# Altium schematic sheet Sheet2.SchDoc
size A3; SheetNumber: 1; SheetTotal: 1
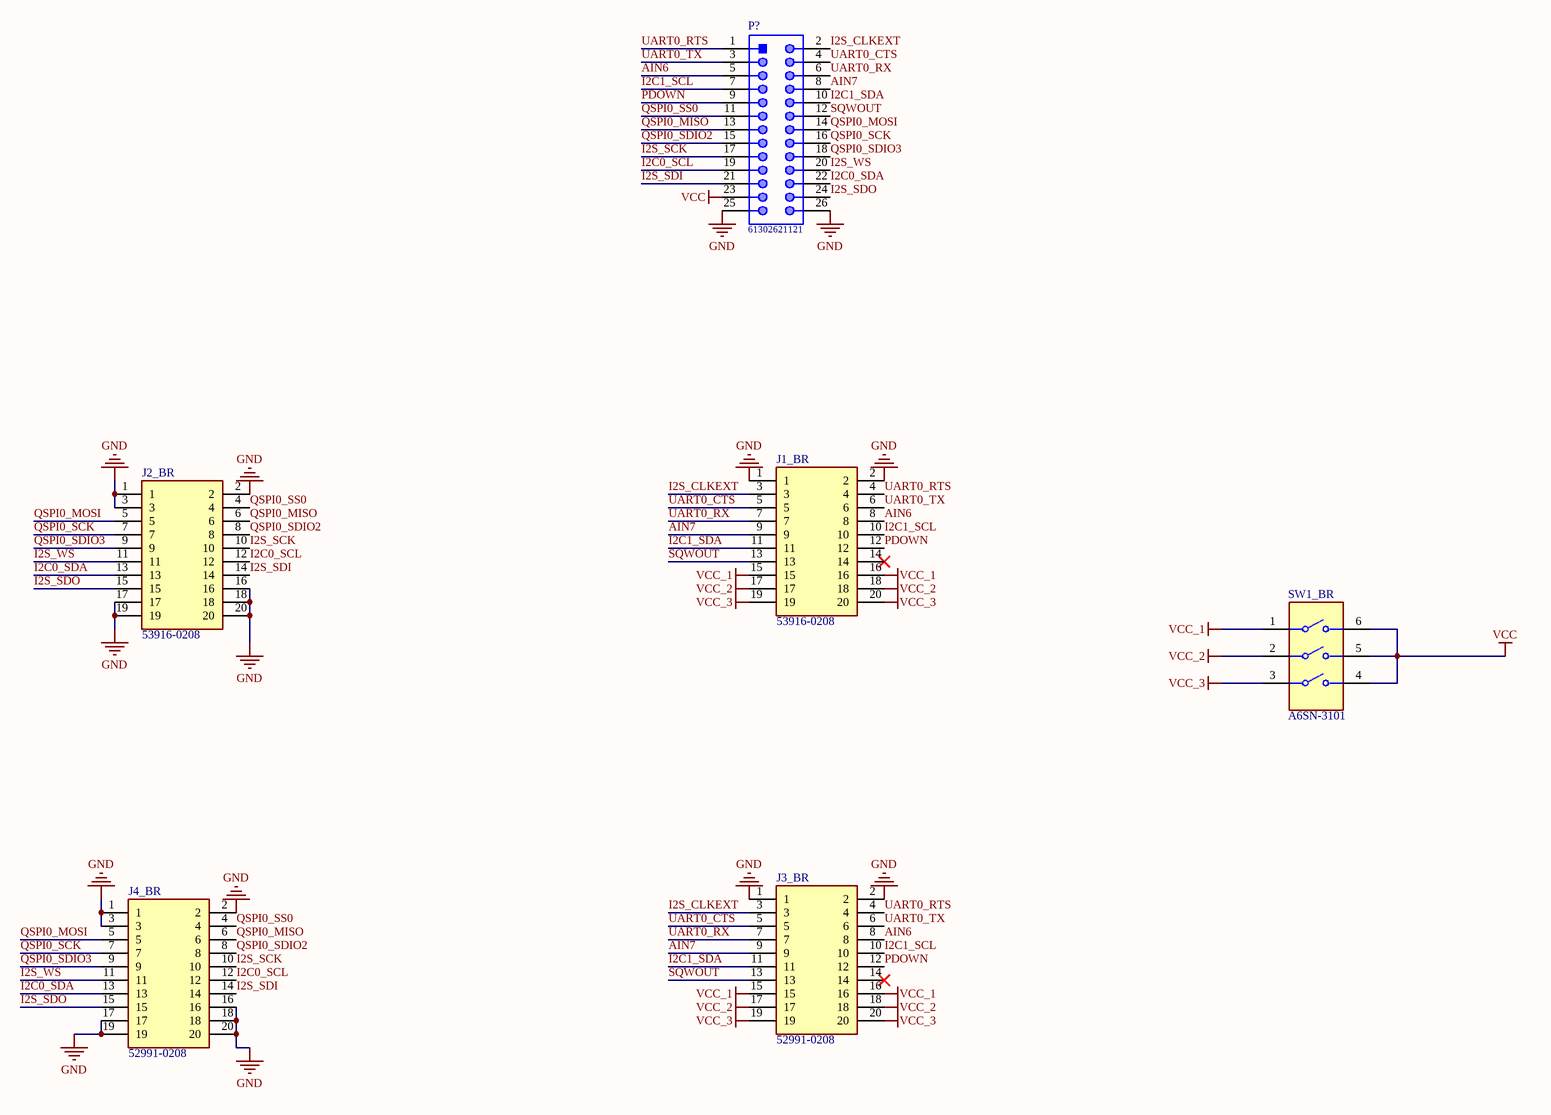
[diagram p0: Sheet2.SchDoc]

## Parts
J1_BR  53916-0208  [MOLEX-  539160208]
J2_BR  53916-0208  [MOLEX-  539160208]
J3_BR  52991-0208  [MOLEX_52991-0208]
J4_BR  52991-0208  [MOLEX_52991-0208]
P?  61302621121  [61302621121]
SW1_BR  A6SN-3101  [FP-A6SN-3101-MFG]

## Nets
GND: J1_BR.1 J1_BR.2 J2_BR.1 J2_BR.2 J2_BR.3 J2_BR.16 J2_BR.17 J2_BR.18 J2_BR.19 J2_BR.20 J3_BR.1 J3_BR.2 J4_BR.1 J4_BR.2 J4_BR.3 J4_BR.16 J4_BR.17 J4_BR.18 J4_BR.19 J4_BR.20 P?.25 P?.26
VCC: P?.23 SW1_BR.4 SW1_BR.5 SW1_BR.6
VCC_1: J1_BR.15 J1_BR.16 J3_BR.15 J3_BR.16 SW1_BR.1
VCC_2: J1_BR.17 J1_BR.18 J3_BR.17 J3_BR.18 SW1_BR.2
VCC_3: J1_BR.19 J1_BR.20 J3_BR.19 J3_BR.20 SW1_BR.3
AIN6: J1_BR.8 J3_BR.8 P?.5
AIN7: J1_BR.9 J3_BR.9 P?.8
I2C0_SCL: J2_BR.12 J4_BR.12 P?.19
I2C0_SDA: J2_BR.13 J4_BR.13 P?.22
I2C1_SCL: J1_BR.10 J3_BR.10 P?.7
I2C1_SDA: J1_BR.11 J3_BR.11 P?.10
I2S_CLKEXT: J1_BR.3 J3_BR.3 P?.2
I2S_SCK: J2_BR.10 J4_BR.10 P?.17
I2S_SDI: J2_BR.14 J4_BR.14 P?.21
I2S_SDO: J2_BR.15 J4_BR.15 P?.24
I2S_WS: J2_BR.11 J4_BR.11 P?.20
PDOWN: J1_BR.12 J3_BR.12 P?.9
QSPI0_MISO: J2_BR.6 J4_BR.6 P?.13
QSPI0_MOSI: J2_BR.5 J4_BR.5 P?.14
QSPI0_SCK: J2_BR.7 J4_BR.7 P?.16
QSPI0_SDIO2: J2_BR.8 J4_BR.8 P?.15
QSPI0_SDIO3: J2_BR.9 J4_BR.9 P?.18
QSPI0_SS0: J2_BR.4 J4_BR.4 P?.11
SQWOUT: J1_BR.13 J3_BR.13 P?.12
UART0_CTS: J1_BR.5 J3_BR.5 P?.4
UART0_RTS: J1_BR.4 J3_BR.4 P?.1
UART0_RX: J1_BR.7 J3_BR.7 P?.6
UART0_TX: J1_BR.6 J3_BR.6 P?.3

Not connected (* = marked no-connect by the designer): J1_BR 14*; J3_BR 14*

## Library data of the parts
J3_BR J4_BR = 52991-0208: 20 Position Connector Receptacle, Center Strip Contacts Surface Mount Gold; MF: Molex; SnapEDA_Link: https://www.snapeda.com/parts/52991-0208/Molex/view-part/230631/?ref=snap; Availability: Unavailable; MP: 52991-0208; Price: None; Package: None; Value: *
P? = CMP-1502-01114-1: THT Vertical Pin Header WR-PHD, Pitch 2.54 mm, Dual Row, 26 pins; Manufacturer: Wurth Elektronik; Pin Number: 26; Withstanding Voltage: 500VAC; Working Voltage: 250VAC; Contact Resistance: 20mOhm; Pitch: 2.54mm; Rated Current: 3A; Gender: Male; Package Reference: 61302621121; Manufacturer URL: http://www.we-online.de; Row Number: Dual; Packaging: Bag; Publisher: WurthElektronik; Datasheet URL: https://katalog.we-online.de/em/datasheet/6130xx21121.pdf; Operating Temperature: -40to105degC; Mounting Technology: THT; Orientation: Vertical; Part Number: 61302621121
SW1_BR = CMP-08827-000007-1: SWITCH SLIDE DIP SPST 25MA 24V; Manufacturer: Omron Electronics Inc-EMC Div; Electromechanical Life: 1000Cycles; Contact Resistance: 200mΩ; Standoff Height: 0.7mm; Number Of Circuits: 3; Device Class L2: Switches; Device Class L3: DIP Switches; Ambient Temperature Range High: +85°C; RoHS: TRUE; Temperature Range High: +85°C; Ambient Temperature Range Low: -30°C; ComponentLink2URL: https://omronfs.omron.com/en_US/ecb/products/pdf/en-a6sn.pdf; Category: Switch; Temperature Range Low: -30°C; Digikey Description: SWITCH SLIDE DIP SPST 25MA 24V; Package: A6SN-3101; Mouser Description: DIP Switches / SIP Switches 3P Knife-Edge, 2.3mm Slide SMT Flat-Act; Device Class L1: Electromechanical; Current Rating: 25mA; Lead Free: Yes; ComponentLink2Description: Datasheet; Throw Configuration: SPST; Voltage Rating Dc: 24V; Height: 4.55mm; Octopart: https://octopart.com/a6sn-3101-omron-55396000; Automotive: No; Manufacturer Part Number: A6SN-3101; Temperature: -30°C to +85°C